# EAGLE design arduino_shield_drumline (EAGLE 8.1.0)
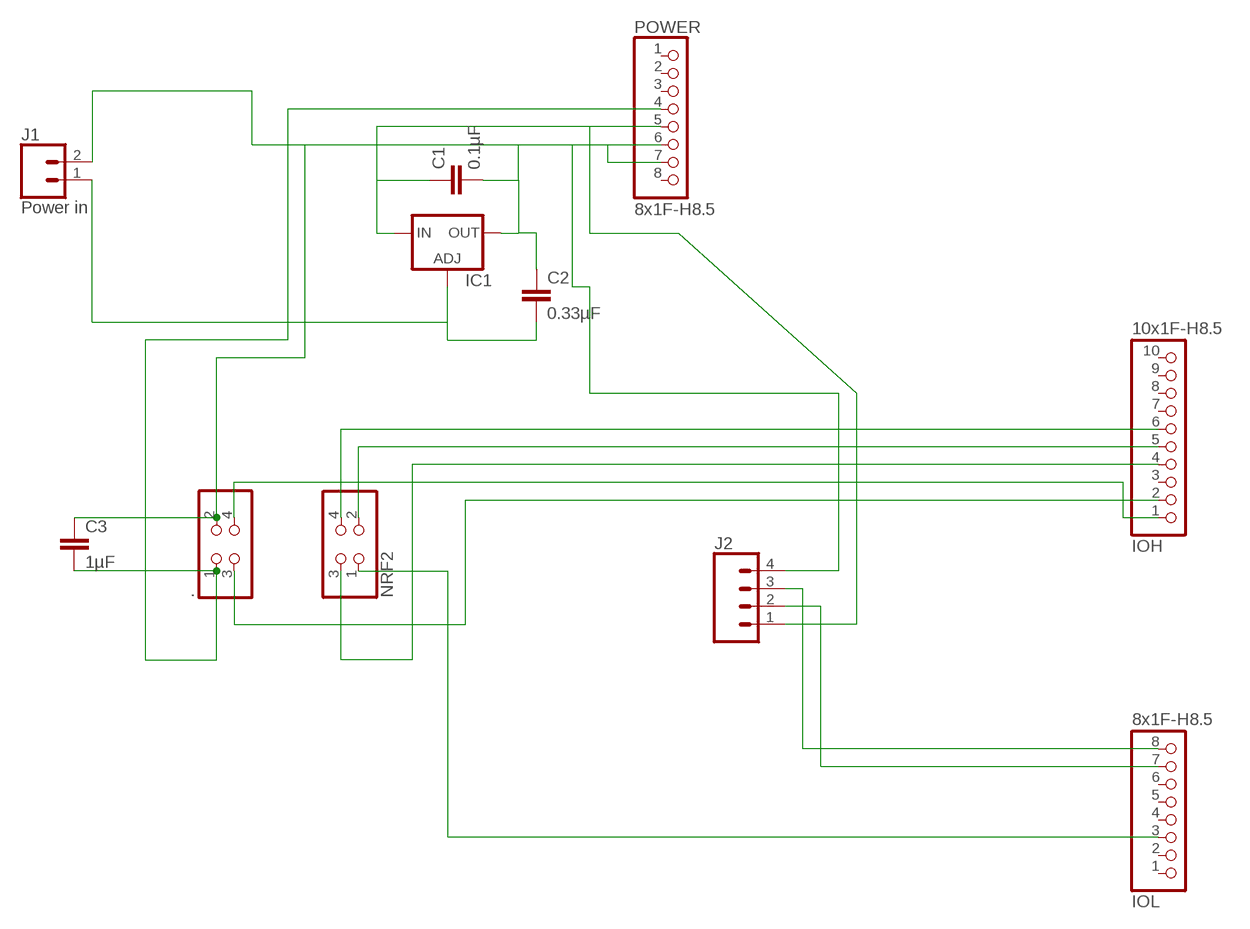
[diagram p0: schematic, sheet 1]

## Parts
.  PINHD-2X2  [2X02]
C1  0.1µF  0.33UF/330NF-0805-50V-10%  [0805]
C2  0.33µF  0.33UF/330NF-0805-50V-10%  [0805]
C3  1µF  0.33UF/330NF-0805-50V-10%  [0805]
IC1  LM138-TS  [TO220S]
IOH  10x1F-H8.5  PINHD-1X10_ARD  [1X10]
IOL  8x1F-H8.5  PINHD-1X8  [1X08]
J1  Power in  CONN_02  [1X02]
J2  CONN_04  [1X04]
NRF2  PINHD-2X2  [2X02]
POWER  8x1F-H8.5  PINHD-1X8  [1X08]

## Nets
GND: ..2 C1.2 C2.1 C3.1 IC1.2(OUT) J1.2 J2.4 POWER.6 POWER.7
N$1: ..1 C3.2 POWER.4
N$2: IOH.5 NRF2.2
N$3: ..4 IOH.1
N$4: ..3 IOH.2
N$5: IOH.6 NRF2.4
N$6: IOL.3 NRF2.1
N$7: IOH.4 NRF2.3
N$8: C1.1 IC1.3(IN) J2.1 POWER.5
N$9: C2.2 IC1.1(ADJ) J1.1
N$10: IOL.8 J2.3
N$11: IOL.7 J2.2
Unconnected: IOH.3 IOH.7 IOH.8 IOH.9 IOH.10 IOL.1 IOL.2 IOL.4 IOL.5 IOL.6 POWER.1 POWER.2 POWER.3 POWER.8

## Library data of the parts
. NRF2 = SmartPrj:PINHD-2X2: PIN HEADER
C1 C3 = SparkFun-Capacitors:0.33UF/330NF: 0.33µF/330nF ceramic capacitors A capacitor is a passive two-terminal electrical component used to store electrical energy temporarily in an electric field.; PROD_ID: CAP-08469; VALUE: 0.33µF
C2 = SparkFun-Capacitors:0.33UF/330NF: 0.33µF/330nF ceramic capacitors A capacitor is a passive two-terminal electrical component used to store electrical energy temporarily in an electric field.; PROD_ID: CAP-08469
IC1 = v-reg:LM138-TS: VOLTAGE REGULATOR
IOH = SmartPrj:PINHD-1X10_ARD: PIN HEADER
IOL POWER = SmartPrj:PINHD-1X8: PIN HEADER
J1 = SparkFun-Connectors:CONN_02: Multi connection point. Often used as Generic Header-pin footprint for 0.1 inch spaced/style header connections On any of the 0.1 inch spaced packages, you can populate with these: Break Away Headers - Straight <https://www.sparkfun.com/products/116> (PRT-00116) Break Away Male Headers - Right Angle <https://www.sparkfun.com/products/553> (PRT-00553) Female Headers <https://www.sparkfun.com/products/115> (PRT-00115) Break Away Headers - Machine Pin <https://www.sparkfun.com/products/117> (PRT-00117) Break Away Female Headers - Swiss Machine Pin <https://www.sparkfun.com/products/743> (PRT-00743) For SCREWTERMINALS and SPRING TERMINALS visit here: Screw Terimnals on SparkFun.com <https://www.sparkfun.com/search/results?term=Screw+Terminals> (5mm/3.5mm/2.54mm spacing) This device is also useful as a general connection point to wire up your design to another part of your project. Our various solder wires solder well into these plated through hole pads. Hook-Up Wire - Assortment (Stranded, 22 AWG) <https://www.sparkfun.com/products/11375> (PRT-11375) Hook-Up Wire - Assortment (Solid Core, 22 AWG) <https://www.sparkfun.com/products/11367> (PRT-11367) View the entire wire category on our website here <https://www.sparkfun.com/categories/141> Special notes: Molex polarized connector foot print use with: PRT-08233 with associated crimp pins and housings. 2.54_SCREWTERM for use with PRT-10571. 3.5mm Screw Terminal footprints for PRT-08084 5mm Screw Terminal footprints for use with PRT-08432
J2 = SparkFun-Connectors:CONN_04: Multi connection point. Often used as Generic Header-pin footprint for 0.1 inch spaced/style header connections On any of the 0.1 inch spaced packages, you can populate with these: Break Away Headers - Straight <https://www.sparkfun.com/products/116> (PRT-00116) Break Away Male Headers - Right Angle <https://www.sparkfun.com/products/553> (PRT-00553) Female Headers <https://www.sparkfun.com/products/115> (PRT-00115) Break Away Headers - Machine Pin <https://www.sparkfun.com/products/117> (PRT-00117) Break Away Female Headers - Swiss Machine Pin <https://www.sparkfun.com/products/743> (PRT-00743) For SCREWTERMINALS and SPRING TERMINALS visit here: Screw Terimnals on SparkFun.com <https://www.sparkfun.com/search/results?term=Screw+Terminals> (5mm/3.5mm/2.54mm spacing) This device is also useful as a general connection point to wire up your design to another part of your project. Our various solder wires solder well into these plated through hole pads. Hook-Up Wire - Assortment (Stranded, 22 AWG) <https://www.sparkfun.com/products/11375> (PRT-11375) Hook-Up Wire - Assortment (Solid Core, 22 AWG) <https://www.sparkfun.com/products/11367> (PRT-11367) View the entire wire category on our website here <https://www.sparkfun.com/categories/141> Special notes: Molex polarized connector foot print use with SKU : PRT-08231 with associated crimp pins and housings. 1MM SMD Version SKU: PRT-10208; PROD_ID: CONN-09696

## Net classes
0 default: width 0.254 mm, clearance 0.254 mm
1 power: width 0.61 mm, drill 0.61 mm, clearance 0.254 mm
2 gnd: width 0.305 mm, drill 0.559 mm, clearance 0.254 mm
3 usbvcc: width 0.508 mm, drill 0.61 mm, clearance 0.254 mm
4 aref: width 0.406 mm, drill 0.61 mm, clearance 0.254 mm

## Board
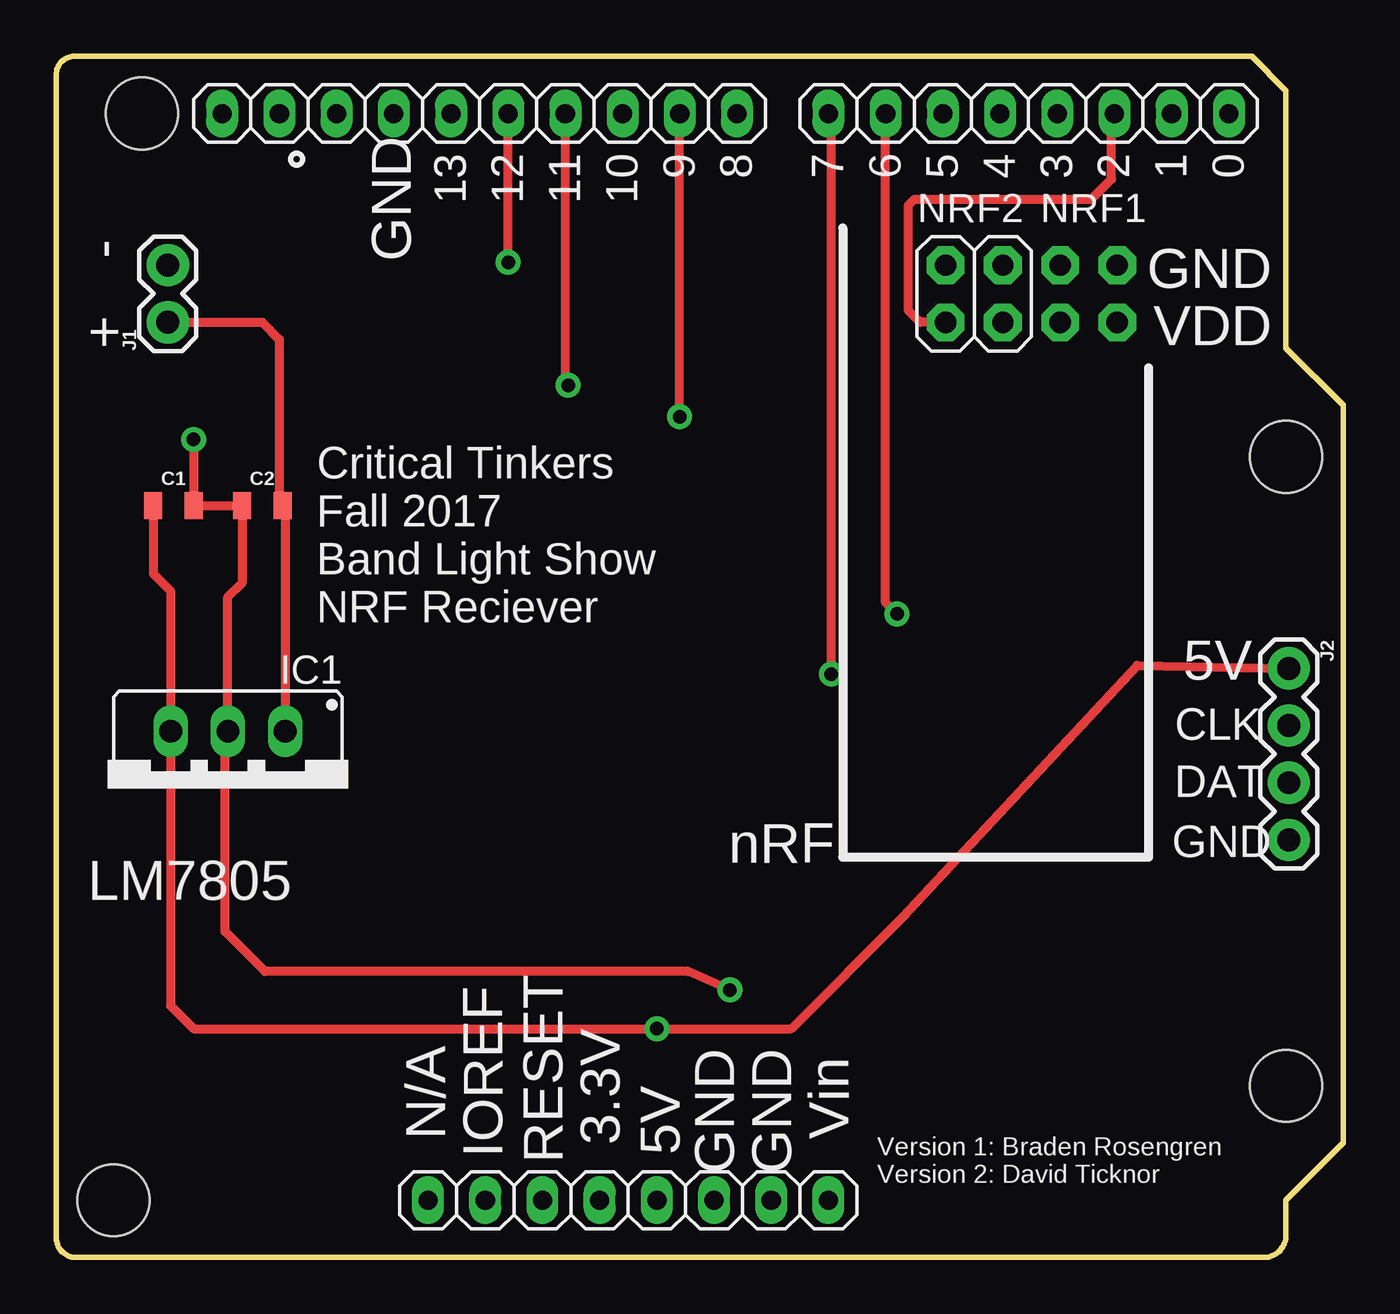
[diagram p1: board, top side]
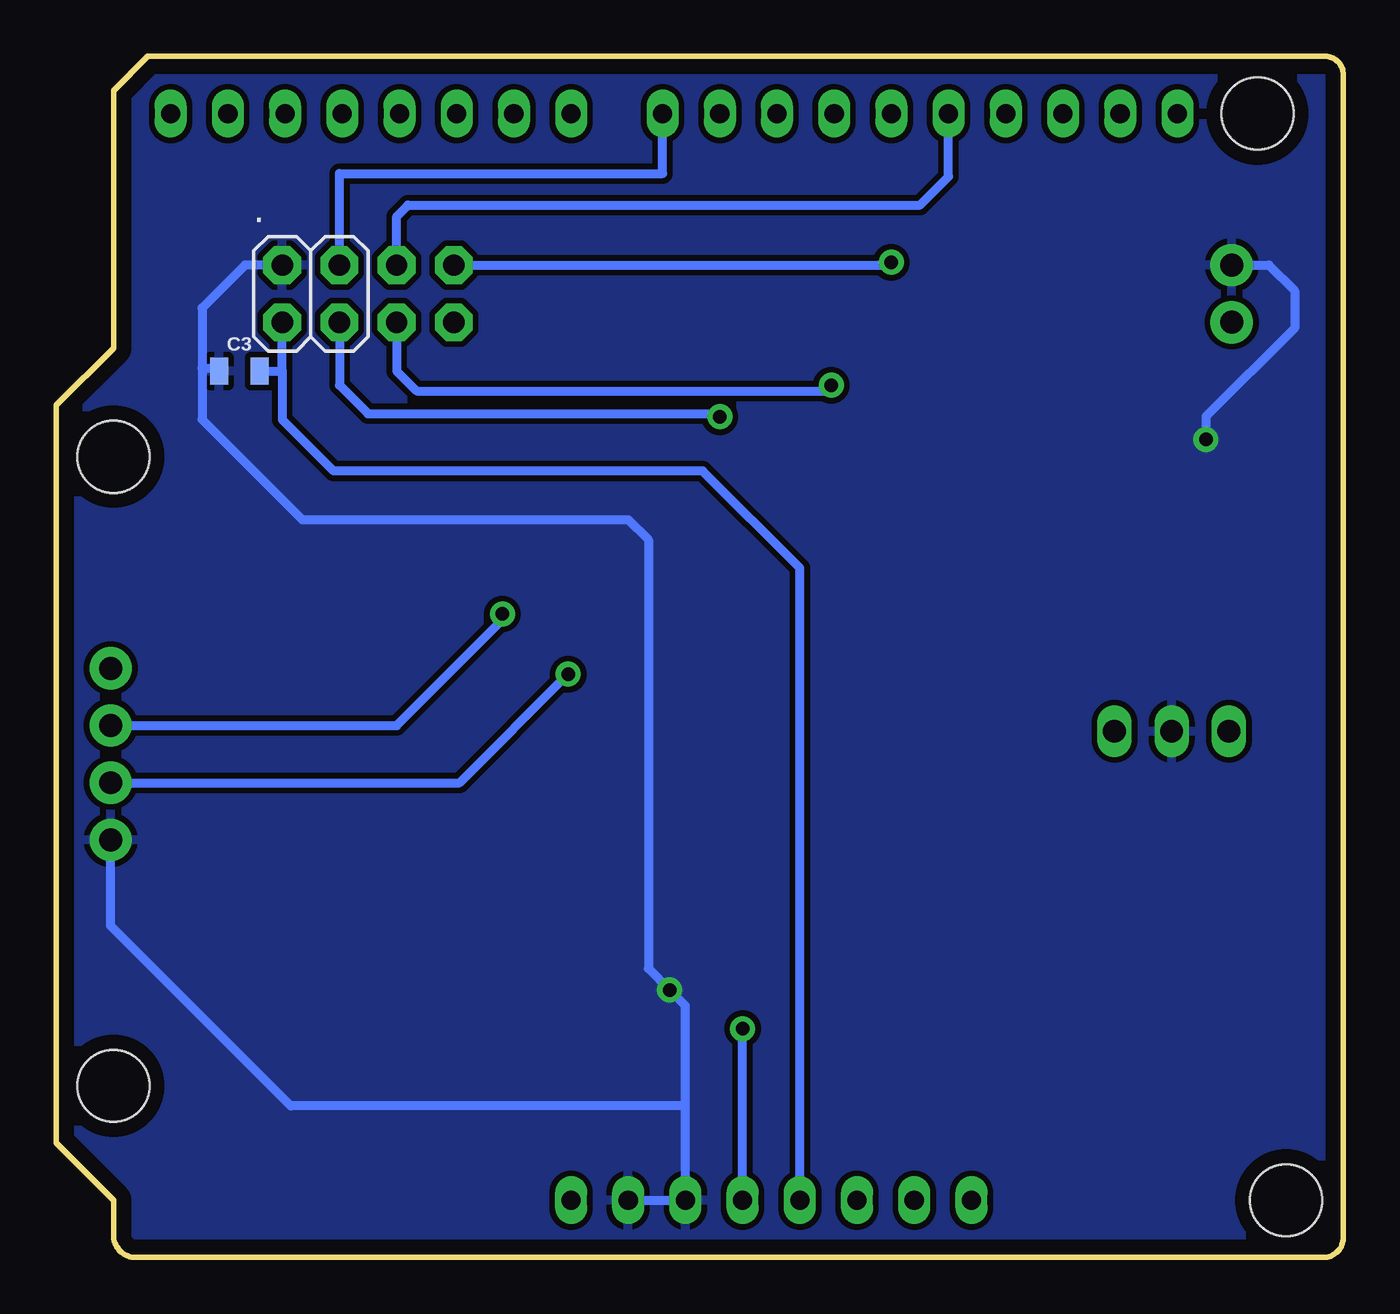
[diagram p2: board, bottom side, seen from below]

Size 57.15 x 53.34 mm. Coordinates in mm from the lower left corner, seen from the top.
Outline: 53.09,53.34 54.61,51.82 54.61,40.39 57.15,37.85 57.15,5.08 54.61,2.54 54.61,1 arc-90 53.61,0 0.87,0 arc-90 0,0.87 0,52.59 arc-90 0.87,53.34 53.09,53.34
Copper layers (1*16): Top 0.035mm / dielectric 1.5mm / Bottom 0.035mm
Design rules "default": minimum track width 10mil, minimum drill 22mil, track to track 10mil, track to pad 10mil, pad to pad 10mil, via to via 12mil, smd to smd 8mil, copper to edge 26mil, drill to drill 12mil, minimum pad ring 10mil, minimum via ring 10mil, stop-mask expansion 1mil, vias tented up to drill 30mil, thermal gap 10mil
Holes 3.2 mm at 54.61,35.56 54.61,7.62 3.81,50.8 2.54,2.54

### Footprints (pad centres in the part's own frame; a part is rotated, then mirrored left to right if it is on the bottom)
2X02 = drill 0.95 pad 1.676 octagon: 1 -1.27,-1.27; 2 -1.27,1.27; 3 1.27,-1.27; 4 1.27,1.27
0805 = smd 0.8 x 1.2: 1 -0.9,0; 2 0.9,0
TO220S = drill 1.016 long: 1 -2.54,-2.54; 2 0,-2.54; 3 2.54,-2.54
1X10 = drill 0.85 pad 1.422 long: 1 -11.43,0; 2 -8.89,0; 3 -6.35,0; 4 -3.81,0; 5 -1.27,0; 6 1.27,0; 7 3.81,0; 8 6.35,0; 9 8.89,0; 10 11.43,0
1X08 = drill 0.85 pad 1.422 long: 1 -8.89,0; 2 -6.35,0; 3 -3.81,0; 4 -1.27,0; 5 1.27,0; 6 3.81,0; 7 6.35,0; 8 8.89,0
1X02 = drill 1.016 pad 1.88: 1 0,0; 2 2.54,0
1X04 = drill 1.016 pad 1.88: 1 0,0; 2 2.54,0; 3 5.08,0; 4 7.62,0

### Placement (x,y rotation side)
.  45.85,42.8 0 bottom
C1  5.21,33.4 0 top
C2  9.14,33.4 0 top
C3  49.02,39.37 0 bottom
IC1  7.62,20.83 180 top
IOH  18.8,50.8 180 top
IOL  43.18,50.8 180 top
J1  4.95,41.53 90 top
J2  54.74,26.16 270 top
NRF2  40.77,42.8 0 top
POWER  25.4,2.54 0 top

### Tracks (layer width: path | path; a pad name or v marks a point on that pad's centre or on a via)
GND  (via drill 0.6)
  Top 0.406: v6.1,36.32 C1.2 C2.1 8.24,29.96 7.62,29.34 IC1.2 7.49,23.24 7.49,14.48 9.27,12.7 28.07,12.7 v29.91,11.88
  Bottom 0.406: POWER.7 POWER.6 29.21,6.73 | J1.2 3.3,44.07 2.16,42.93 2.16,41.28 6.1,37.34 v6.1,36.32 | 29.21,6.73 29.21,11.18 v29.91,11.88 30.86,12.83 30.86,31.88 31.75,32.77 46.23,32.77 50.67,37.21 50.67,39.5 | ..2 48.77,44.07 50.67,42.16 50.67,39.5 | 50.67,39.5 50.05,39.5 C3.1 | 29.21,6.73 46.74,6.73 54.74,14.73 J2.4
  pour Bottom: 0.89,0 arc-90 0,0.89 0,52.71 arc-90 0.64,53.34 53.09,53.34 54.61,51.82 54.61,40.39 57.15,37.85 57.15,5.08 54.61,2.54 54.61,1.02 arc-90 53.59,0
N$1
  Bottom 0.406: POWER.4 24.13,30.61 28.45,34.93 44.83,34.93 47.12,37.21 47.12,39.37 | 47.12,39.37 ..1 | C3.2 47.12,39.37
N$2  (via drill 0.6)
  Top 0.406: v20.07,44.2 IOH.5
  Bottom 0.406: NRF2.2 20.19,44.07 v20.07,44.2
N$3
  Bottom 0.406: ..4 44.58,48.13 30.23,48.13 IOH.1
N$4  (via drill 0.6)
  Top 0.406: v27.69,37.34 IOH.2
  Bottom 0.406: ..3 44.58,38.73 43.31,37.47 27.81,37.47 v27.69,37.34
N$5
  Bottom 0.406: NRF2.4 42.04,46.23 41.53,46.74 18.8,46.74 17.53,48.01 IOH.6
N$6
  Top 0.406: NRF2.1 38.35,41.53 37.85,42.04 37.85,46.74 38.1,46.99 45.97,46.99 46.86,47.88 46.86,50.67 IOL.3
N$7  (via drill 0.6)
  Top 0.406: v22.73,38.73 22.61,38.73 IOH.4
  Bottom 0.406: NRF2.3 42.04,39.37 41.15,38.48 22.99,38.48 v22.73,38.73
N$8  (via drill 0.6)
  Top 0.406: C1.1 4.31,30.36 5.08,29.59 IC1.3 5.08,11.18 6.1,10.16 v26.67,10.16 32.64,10.16 37.59,15.11 48.01,26.29 J2.1
  Bottom 0.406: POWER.5 v26.67,10.16 26.67,10.29
N$9
  Top 0.406: IC1.1 10.16,33.4 C2.2 9.91,33.54 9.91,40.77 9.14,41.53 J1.1
N$10  (via drill 0.6)
  Top 0.406: v34.42,25.91 34.42,50.67 IOL.8
  Bottom 0.406: J2.3 39.24,21.08 v34.42,25.91
N$11  (via drill 0.6)
  Top 0.406: v37.34,28.57 36.83,29.08 IOL.7
  Bottom 0.406: J2.2 42.04,23.62 37.21,28.45 v37.34,28.57

### Text on the board
tPlace: GND | 13 | 12 | 11 | 10 | 9 | 8 | 7 | 6 | 5 | 4 | 3 | 2 | 1 | 0 | NRF1 | - | GND | VDD | + | Critical Tinkers / Fall 2017 / Band Light Show / NRF Reciever | 5V | CLK | DAT | nRF | GND | LM7805 | RESET | IOREF | N/A | 3.3V | GND | GND | Vin | 5V | Version 1: Braden Rosengren / Version 2: David Ticknor
214bmp: D:/SmartProjects/Snc/a4_bn_logo2.bmp